# Altium schematic sheet 02 - Power.SchDoc
size A4
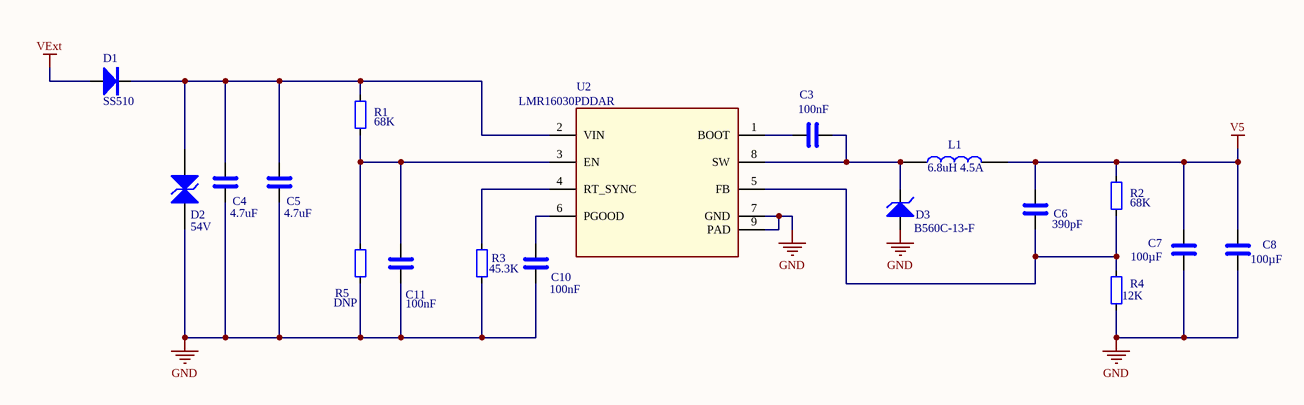
[diagram p0: 02 - Power.SchDoc]

## Parts
C3  100nF  [CAP_0603]
C4  4.7uF  [C_1210_3225Metric]
C5  4.7uF  [C_1210_3225Metric]
C6  390pF  [CAP_0603]
C7  100µF  [C_1210_3225Metric]
C8  100µF  [C_1210_3225Metric]
C10  100nF  [CAP_0603]
C11  100nF  [CAP_0603]
D1  value SS510  [S1M-13-F]  (hidden comment: DIODE SCHOTTKY 100V 5A DO214AC)
D2  value 54V  [SMBJ54CA-HT]  (hidden comment: SMBJ54CA-HT)
D3  B560C-13-F  [SMC_DIO]
L1  6.8uH 4.5A  [IHLP2525CZER6R8M01]
R1  68K  [RES_0603]
R2  68K  [RES_0603]
R3  45.3K  [RES_0603]
R4  12K  [RES_0603]
R5  DNP  [RES_0603]
U2  LMR16030PDDAR  [LMR16030PDDAR]

## Nets
GND: C4.2 C5.2 C7.2 C8.2 C10.2 C11.2 D2.1(A) D3.2(A) R3.1 R4.1 R5.1 U2.7(GND) U2.9(PAD)
V5: C6.1 C7.1 C8.1 L1.2 R2.2
VExt: D1.2(A)
NetC3_1: C3.1 U2.1(BOOT)
NetC3_2: C3.2 D3.1(K) L1.1 U2.8(SW)
NetC4_1: C4.1 C5.1 D1.1(K) D2.2(K) R1.2 U2.2(VIN)
NetC6_2: C6.2 R2.1 R4.2 U2.5(FB)
NetC10_1: C10.1 U2.6(PGOOD)
NetC11_1: C11.1 R1.1 R5.2 U2.3(EN)
NetR3_2: R3.2 U2.4(RT_SYNC)

## Notes on the sheet
- Title
- Size:
- Date:
- A4
- Number:
- Time:
- Revision:
- Sheet
- of
- File:

## Library data of the parts
C3 C10 C11 = C: pdf: https://www.lcsc.com/datasheet/lcsc_datasheet_2501031500_HRE-CGA0603X7R104K500JT_C6119867.pdf; LCSC PART: C6119867; lcsc link: https://www.lcsc.com/product-detail/Multilayer-Ceramic-Capacitors-MLCC-SMD-SMT_HRE-CGA0603X7R104K500JT_C6119867.html?s_z=n_100nF; JLCPCB: C6119867; Value: 100nF
C4 C5 = C: Value: 4.7uF 100V; JLCPCB: C381466; LCSC PART: C381466; lcsc link: https://www.lcsc.com/product-detail/Multilayer-Ceramic-Capacitors-MLCC-SMD-SMT_PSA-Prosperity-Dielectrics-FS32X475K101EGG_C381466.html
C6 = C: 50V 390pF X7R ±10% 0603 Multilayer Ceramic Capacitors MLCC - SMD/SMT ROHS; JLCPCB: C1617; Value: 390pF; LCSC PART: C1617; lcsc link: https://www.lcsc.com/product-detail/Multilayer-Ceramic-Capacitors-MLCC-SMD-SMT_FH-Guangdong-Fenghua-Advanced-Tech-0603B391K500NT_C1617.html?s_z=n_390pF
C7 C8 = C: 6.3V 100uF X5R ±20% 1210 Multilayer Ceramic Capacitors MLCC - SMD/SMT ROHS; JLCPCB: C49066; Value: 100µF; LCSC PART: C49066; lcsc link: https://www.lcsc.com/product-detail/Multilayer-Ceramic-Capacitors-MLCC-SMD-SMT_Samsung-Electro-Mechanics-CL32A107MQVNNNE_C49066.html?s_z=n_C49066
D1 = DIODE SCHOTTKY 100V 5A DO214AC: MFN: SS510-HT; STOK KOD: HM0953; TYPE: SMD; NAME: DIODE SCHOTTKY 100V 5A DO214AC; Datasheet: https://www.smc-diodes.com/propdf/SK510%20N1113%20REV.A.pdf; lcsc link: https://www.lcsc.com/product-detail/Schottky-Diodes_MDD-Microdiode-Semiconductor-SS510_C65010.html; JLCPCB: C65010; LCSC PART: C65010; pdf: https://www.lcsc.com/datasheet/lcsc_datasheet_2411211954_MDD-Microdiode-Semiconductor-SS510_C65010.pdf
D2 = DIODE TVS 600W 54V DO214AA SMB: 600W Bidirectional 54V SMB ESD and Surge Protection (TVS/ESD) ROHS; STOK KOD: HM0531; TYPE: SMD; MFN: SMBJ54CA-HT; NAME: DIODE TVS 600W 54V DO214AA SMB; Datasheet: https://www.littelfuse.com/~/media/electronics/datasheets/tvs_diodes/littelfuse_tvs_diode_smbj_datasheet.pdf.pdf; lcsc link: https://www.lcsc.com/product-detail/ESD-and-Surge-Protection-TVS-ESD_FOSAN-SMBJ54CA_C5353227.html?s_z=n_SMBJ54CA; LCSC PART: C5353227; pdf: https://www.lcsc.com/datasheet/lcsc_datasheet_2301131609_FOSAN-SMBJ54CA_C5353227.pdf; JLCPCB: C5353227
D3 = B560C: 60V 700mV@5A 5A SMC(DO-214AB) Schottky Diodes ROHS; Value: B560C-13-F; LCSC PART: C85100; JLCPCB: C85100; lcsc link: https://www.lcsc.com/product-detail/Schottky-Diodes_Diodes-Incorporated-B560C-13-F_C85100.html?s_z=n_b560c; pdf: https://www.lcsc.com/datasheet/lcsc_datasheet_2412251154_Diodes-Incorporated-B560C-13-F_C85100.pdf
L1 = FIXED IND 6.8UH 4.5A 60 MOHM SMD: 4.5A 6.8uH ±20% 8A SMD,6.5x6.9mm Power Inductors ROHS; MFN: IHLP2525CZER6R8M01; TYPE: SMD; JLCPCB: C506575; LCSC PART: C506575; lcsc link: https://www.lcsc.com/product-detail/Power-Inductors_Vishay-Intertech-IHLP2525CZER6R8M01_C506575.html?s_z=n_IHLP2525CZER6R8M01; pdf: https://www.lcsc.com/datasheet/lcsc_datasheet_2409300703_Vishay-Intertech-IHLP2525CZER6R8M01_C506575.pdf; Value: 6.8uH 4.5A
R1-R5 = R
  R1 R2: Value: 68K; JLCPCB: C114633; LCSC PART: C114633; lcsc link: https://www.lcsc.com/product-detail/Chip-Resistor-Surface-Mount_YAGEO-RC0603FR-0768KL_C114633.html?s_z=n_68K
  R3: Value: 45.3K; LCSC PART: C23058; JLCPCB: C23058; lcsc link: https://www.lcsc.com/product-detail/Chip-Resistor-Surface-Mount_UNI-ROYAL-Uniroyal-Elec-0603WAF4532T5E_C23058.html
  R4: Value: 12K; JLCPCB: C114659; LCSC PART: C114659; lcsc link: https://www.lcsc.com/product-detail/Chip-Resistor-Surface-Mount_YAGEO-RC0603FR-0712KL_C114659.html?s_z=n_12k
  R5: Value: DNP
U2 = IC REG BUCK ADJUSTABLE 3A 8SOPWR: Step-down type Adjustable 800mV~50V 3A 4.3V~60V SOIC-8-EP DC-DC Converters ROHS; STOK KOD: HM0056; MFN: LMR16030PDDAR; TYPE: SMD; NAME: IC REG BUCK ADJUSTABLE 3A 8SOPWR; Datasheet: https://www.ti.com/general/docs/suppproductinfo.tsp?distId=10&gotoUrl=https%3A%2F%2Fwww.ti.com%2Flit%2Fgpn%2Flmr16030; LCSC PART: C90665; JLCPCB: C90665; lcsc link: https://www.lcsc.com/product-detail/DC-DC-Converters_Texas-Instruments-LMR16030PDDAR_C90665.html?s_z=n_LMR16030PDDAR; pdf: https://www.lcsc.com/datasheet/lcsc_datasheet_2410121701_Texas-Instruments-LMR16030PDDAR_C90665.pdf; Value: LMR16030PDDAR